# Altium schematic sheet USB Sheet (ATmega8U2-MU).SchDoc
size A4
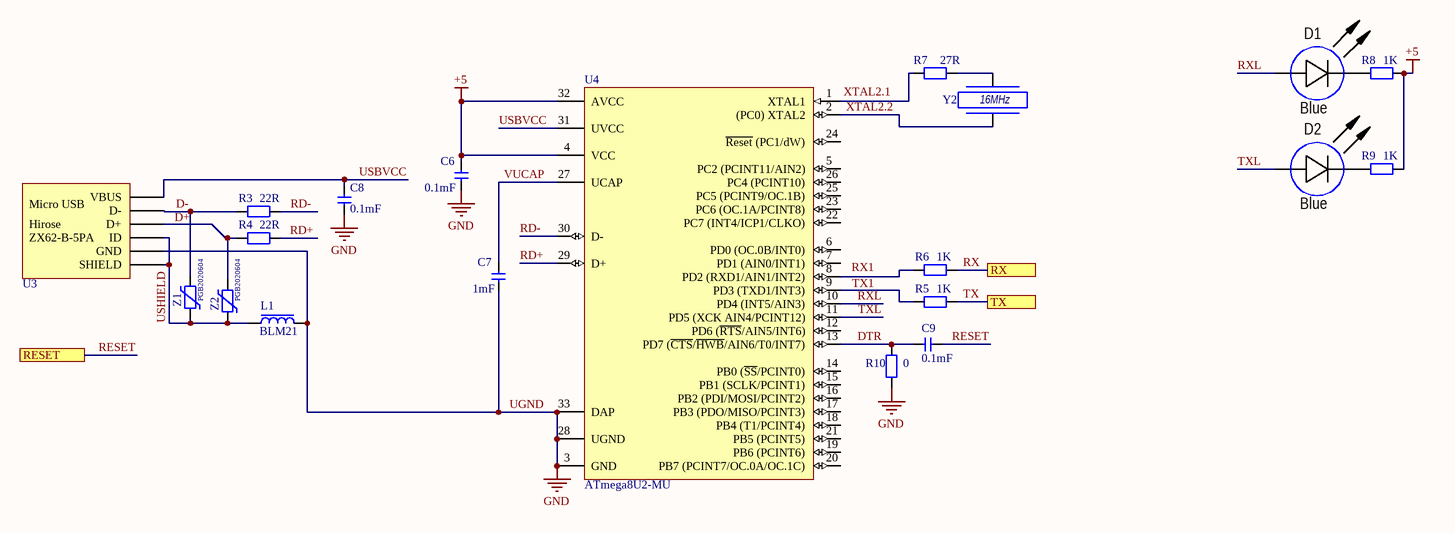
[diagram p0: USB Sheet (ATmega8U2-MU).SchDoc]

## Parts
C6  0.1mF  [cap0603]
C7  1mF  [cap0603]
C8  0.1mF  [cap0603]
C9  0.1mF  [cap0603]
D1  Blue  [CH0805LB]
D2  Blue  [CH0805LB]
L1  BLM21  [res0805]
R3  22R  [res0603]
R4  22R  [res0603]
R5  1K  [res0603]
R6  1K  [res0603]
R7  27R  [res0603]
R8  1K  [res0603]
R9  1K  [res0603]
R10  0  [res0603]
U3  ZX62-B-5PA  [ZX62-B-5PA]  (value not drawn)
U4  ATmega8U2-MU  [32PG_N]
Y2  16MHz  [QSMD5.0x3.2x1.0]
Z1  PGB2020604  [res0603]
Z2  PGB2020604  [res0603]

## Ports
RESET, RX, TX

## Nets
+5: C6.2 R8.2 R9.2 U4.4(VCC) U4.32(AVCC)
UGND: C6.1 C7.1 C8.1 L1.2 R10.1 U3.5(GND) U4.3(GND) U4.28(UGND) U4.33(DAP)  [also labelled GND]
D-: R3.1 U3.2(D-) Z1.2
DTR: C9.1 R10.2 U4.13(PD7_(~{CTS}/~{HWB}/AIN6/T0/INT7))
RD+: R4.2 U4.29(D+)
RD-: R3.2 U4.30(D-)
RESET: C9.2 ; port RESET
RX: R6.2 ; port RX
RXL: D1.1(A) U4.10(PD4_(INT5/AIN3))
TX: R5.2 ; port TX
TXL: D2.1(A) U4.11(PD5_(XCK_AIN4/PCINT12))
USBVCC: C8.2 U3.1(VBUS) U4.31(UVCC)
USHIELD: L1.1 U3.4(ID) U3.6(SHIELD) Z1.1 Z2.1
VUCAP: C7.2 U4.27(UCAP)
XTAL2.2: U4.2((PC0)_XTAL2) Y2.1
NetD1_2: D1.2(C) R8.1
NetD2_2: D2.2(C) R9.1
NetR4_1: R4.1 U3.3(D+) Z2.2
NetR5_1: R5.1 U4.9(PD3_(TXD1/INT3))
NetR6_1: R6.1 U4.8(PD2_(RXD1/AIN1/INT2))
NetR7_1: R7.1 U4.1(XTAL1)
NetR7_2: R7.2 Y2.2

Not connected (* = marked no-connect by the designer): U4 5(PC2_(PCINT11/AIN2)) 6(PD0_(OC.0B/INT0)) 7(PD1_(AIN0/INT1)) 12(PD6_(~{RTS}/AIN5/INT6)) 14(PB0_(~{SS}/PCINT0)) 15(PB1_(SCLK/PCINT1)) 16(PB2_(PDI/MOSI/PCINT2)) 17(PB3_(PDO/MISO/PCINT3)) 18(PB4_(T1/PCINT4)) 19(PB6_(PCINT6)) 20(PB7_(PCINT7/OC.0A/OC.1C)) 21(PB5_(PCINT5)) 22(PC7_(INT4/ICP1/CLKO)) 23(PC6_(OC.1A/PCINT8)) 24(~{Reset}_(PC1/dW)) 25(PC5_(PCINT9/OC.1B)) 26(PC4_(PCINT10))

## Notes on the sheet
- Labels drawn without touching a wire or pin: D+, RX1, TX1, XTAL2.1
- (in symbol ZX62-B-5PA) Micro USB; Hirose

## Library data of the parts
C6-C9 = Cap SMD
D1 D2 = LED: Manufacturer: *; Model: *; HelpURL: *; ComponentKind: *; Value: *
L1 = Drossel
R3-R10 = Resistor SMD
U4 = ATmega8U2-MU: 8-bit AVR Microcontroller, 2.7-5.5V, 8KB Flash, 512 Bytes EEPROM, 512 Bytes SRAM, 32-pin VQFN, Industrial Grade (-40°C to 85°C); Published: 1-Apr-2010; DatasheetVersion: revC, Dec-2009; PackageVersion: revA, Oct-2008; PackageReference: 32PG; Publisher: Altium Limited; PackageDescription: 32-Pin Quad Flat No-Lead (QFN) Sawn,  5 x 5 x 1.0 mm Body, Pitch 0.50 mm, 3.60mm Exposed Pad; Supplier 1: Digi-Key; Supplier Part Number 1: ATMEGA8U2-MU-ND; Supplier 2: Farnell; Supplier Part Number 2: 1748536; Supplier 3: Mouser; Supplier Part Number 3: 556-ATMEGA8U2-MU; Code_JEDEC: MO-220WHHD-2; ComponentLink1Description: Manufacturer Link; ComponentLink1URL: http://www.atmel.com/products/avr/default.asp?; ComponentLink2Description: ATmega8U2/16U2/32U2 Datasheet; ComponentLink2URL: http://www.atmel.com/dyn/resources/prod_documents/doc7799.pdf; ComponentLink3Description: ATmega8U2/16U2/32U2 Summary; ComponentLink3URL: http://www.atmel.com/dyn/resources/prod_documents/7799S.pdf; ComponentLink4Description: Atmel.com Home; ComponentLink4URL: http://www.atmel.com
Y2 = Crystal: Кварцевый резонатор; Value: 16MHz
Z1 Z2 = Varistor